# Altium schematic sheet Ultra-Mega-PS-PowerStage-V1.00.SchDoc: Ultra-Mega-PowerSupply
size A4; Author: Felipe Navarro; Revision: 1.0; SheetNumber: 5; SheetTotal: 5; ProjectName: Ultra-Mega-Power-Supply
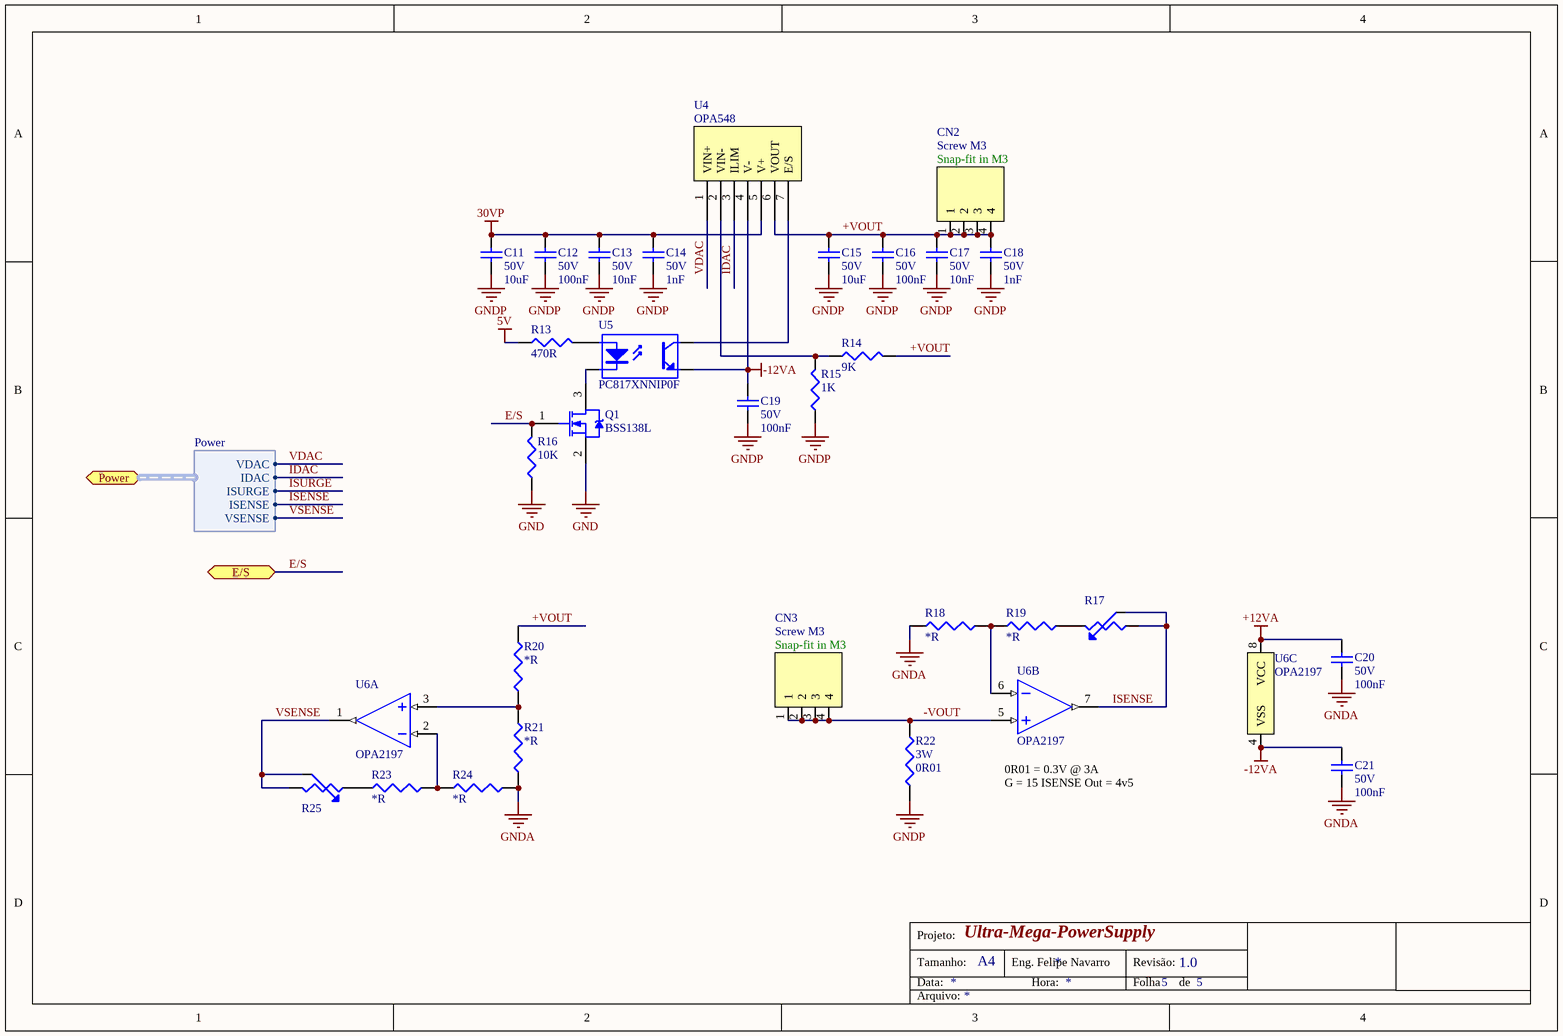
[diagram p0: Ultra-Mega-PS-PowerStage-V1.00.SchDoc]

## Parts
C11  value 10uF  Tensão: 50V  [CC1206]  (hidden comment: Capacitor Cerâmico)
C12  value 100nF  Tensão: 50V  [CC0603]  (hidden comment: Capacitor Cerâmico)
C13  value 10nF  Tensão: 50V  [CC0603]  (hidden comment: Capacitor Cerâmico)
C14  value 1nF  Tensão: 50V  [CC0603]  (hidden comment: Capacitor Cerâmico)
C15  value 10uF  Tensão: 50V  [CC1206]  (hidden comment: Capacitor Cerâmico)
C16  value 100nF  Tensão: 50V  [CC0603]  (hidden comment: Capacitor Cerâmico)
C17  value 10nF  Tensão: 50V  [CC0603]  (hidden comment: Capacitor Cerâmico)
C18  value 1nF  Tensão: 50V  [CC0603]  (hidden comment: Capacitor Cerâmico)
C19  value 100nF  Tensão: 50V  [CC0603]  (hidden comment: Capacitor Cerâmico)
C20  value 100nF  Tensão: 50V  [CC0603]  (hidden comment: Capacitor Cerâmico)
C21  value 100nF  Tensão: 50V  [CC0603]  (hidden comment: Capacitor Cerâmico)
CN2  Screw M3  value Snap-fit in M3  [CONN_MASSA-M3]
CN3  Screw M3  value Snap-fit in M3  [CONN_MASSA-M3]
Q1  BSS138L  [SOT-23-3N]
R13  value 470R  [CC0603]  (hidden comment: Resistor)
R14  value 9K  [CC0603]  (hidden comment: Resistor)
R15  value 1K  [CC0603]  (hidden comment: Resistor)
R16  value 10K  [CC0603]  (hidden comment: Resistor)
R17  Potenciômetro  [POT]  (value not drawn)
R18  value *R  [CC0603]  (hidden comment: Resistor)
R19  value *R  [CC0603]  (hidden comment: Resistor)
R20  value *R  [CC0603]  (hidden comment: Resistor)
R21  value *R  [CC0603]  (hidden comment: Resistor)
R22  value 0R01  Potência: 3W  [CC2512]  (hidden comment: Resistor)
R23  value *R  [CC0603]  (hidden comment: Resistor)
R24  value *R  [CC0603]  (hidden comment: Resistor)
R25  Potenciômetro  [POT]  (value not drawn)
U4  OPA548  [TO-220-7N]
U5  PC817XNNIP0F  [SMD-4N]
U6  OPA2197  [SOIC-8N]  (parts A,B,C of 3)

## Ports
E/S, Power (harness Power)

## Harnesses
Power: VDAC, IDAC, ISENSE, VSENSE, ISURGE

## Nets
5V: R13.1
30VP: C11.2 C12.2 C13.2 C14.2 U4.5(V+)
+12VA: C20.2 U6.8(VCC)
-12VA: C19.2 C21.2 U4.4(V-) U5.3(S) U6.4(VSS)
GND: Q1.2(S) R16.1
GNDA: C20.1 C21.1 R18.1 R21.1 R24.2
GNDP: C11.1 C12.1 C13.1 C14.1 C15.1 C16.1 C17.1 C18.1 C19.1 R15.1 R22.1
+VOUT: C15.2 C16.2 C17.2 C18.2 CN2.1 CN2.2 CN2.3 CN2.4 R14.1 R20.2 U4.6(VOUT)
-VOUT: CN3.1 CN3.2 CN3.3 CN3.4 R22.2 U6.5(INB+)
E/S: Q1.1(G) R16.2 ; port E/S
IDAC: U4.3(ILIM) ; port Power.IDAC
ISENSE: R17.2(TAP) R17.3 U6.7(OUTB) ; port Power.ISENSE
ISURGE: port Power.ISURGE
VDAC: U4.1(VIN+) ; port Power.VDAC
VSENSE: R25.2(TAP) R25.3 U6.1(OUTA) ; port Power.VSENSE
NetQ1_3: Q1.3(D) U5.2(K)
NetR13_2: R13.2 U5.1(A)
NetR14_2: R14.2 R15.2 U4.2(VIN-)
NetR17_1: R17.1 R19.2
NetR18_2: R18.2 R19.1 U6.6(INB-)
NetR20_1: R20.1 R21.2 U6.3(INA+)
NetR23_1: R23.1 R25.1
NetR23_2: R23.2 R24.1 U6.2(INA-)
NetU4_7: U4.7(E/S) U5.4(D)

## Notes on the sheet
- (near U6) 0R01 = 0.3V @ 3A
  G = 15 ISENSE Out = 4v5
- Projeto:
- Tamanho:
- Data:
- A4
- Eng. Felipe Navarro
- Hora:
- Revisão:
- Folha
- de
- Arquivo:

## Library data of the parts
C11 C15 = Cap 10uF 50V 1206 X5R: Capacitor (Semiconductor SIM Model); Chinês: -----; ChinesePrice: 0,00000; Corrente: *A; Potência: *W; Obs:: X5R, CL31A106KBHNNNE; Tolerância: ±10%; Supplier 1: Digi-Key; Supplier Part Number 1: 1276-2876-1-ND; ComponentLink1Description: Datasheet; ComponentLink1URL: D:\Tecnoclade\Datasheet\!DataMissing.pdf
C12 C16 C19-C21 = Cap 100nF 50V 0603 X7R: Capacitor (Semiconductor SIM Model); Chinês: Local; ChinesePrice: 0,00250; Corrente: *A; Potência: *W; Obs:: X7R; Tolerância: ±10%; Supplier 1: Digi-Key; Supplier Part Number 1: 1276-1000-1-ND; ComponentLink1Description: Datasheet; ComponentLink1URL: D:\Tecnoclade\Datasheet\!DataMissing.pdf
C13 C17 = Cap 10nF 50V 0603 X7R 5%: Capacitor (Semiconductor SIM Model); Chinês: Local; ChinesePrice: 0,00320; Corrente: *A; Potência: *W; Obs:: X7R; Tolerância: ±5%; Supplier 1: Digi-Key; Supplier Part Number 1: 399-1092-1-ND; ComponentLink1Description: Datasheet; ComponentLink1URL: D:\Tecnoclade\Datasheet\!DataMissing.pdf
C14 C18 = Cap 1nF 50V 0603 X7R: Capacitor (Semiconductor SIM Model); Chinês: -----; ChinesePrice: 0,00000; Corrente: *A; Potência: *W; Obs:: X7R; Tolerância: ±10%; Supplier 1: Digi-Key; Supplier Part Number 1: 1276-1916-1-ND; ComponentLink1Description: Datasheet; ComponentLink1URL: D:\Tecnoclade\Datasheet\!DataMissing.pdf
CN2 CN3 = Screw Snap-Fit M3: TERM PCB SNAP-IN VERT M3 THREAD; ChinesePrice: 0,00000; Chinês: -----; Corrente: 15A; Obs:: Screw Terminal, Power Tap; Potência: *; Supplier 1: Digi-Key; Supplier Part Number 1: 7788K-ND; Tensão: *; Tolerância: *; ComponentLink1Description: Datasheet; ComponentLink1URL: D:\Tecnoclade\Datasheet\!DataMissing.pdf
Q1 = TRS BSS138 50V 200mA SOT-23-3N: N-Channel Power MOSFET; ChinesePrice: 0,02950; Chinês: Local; Corrente: 200mA; Potência: 1/5W; Tensão: 50V; Supplier 1: Digi-Key; Supplier Part Number 1: BSS138LT3GOSCT-ND; Value: *; Obs:: *; Tolerância: *; ComponentLink1Description: Datasheet; ComponentLink1URL: D:\Tecnoclade\Datasheet\!DataMissing.pdf
R13 = Res 470R 5% 0603 1/10W: ChinesePrice: 0,00000; Chinês: ----; Corrente: *A; Potência: 1/10W; Tensão: *V; Obs: ±200ppm/ºC; Tolerância: ±5%; Supplier 1: Digi-Key; Supplier Part Number 1: RMCF0603JT470RCT-ND; ComponentLink1Description: Datasheet; ComponentLink1URL: D:\Tecnoclade\Datasheet\!DataMissing.pdf
R14 = Res 9K09 1% 0603 1/10W: ChinesePrice: 0,00000; Chinês: ----; Corrente: *A; Potência: 1/10W; Tensão: *V; Obs: ±100ppm/ºC; Tolerância: ±1%; Supplier 1: Digi-Key; Supplier Part Number 1: RMCF0603FT9K0CT-ND; ComponentLink1Description: Datasheet; ComponentLink1URL: D:\Tecnoclade\Datasheet\!DataMissing.pdf
R15 = Res 1K 1% 0603 1/10W: ChinesePrice: 0,00089; Chinês: Local; Corrente: *A; Potência: 1/10W; Tensão: *V; Tolerância: ±1%; Supplier 1: Digi-Key; Supplier Part Number 1: RMCF0603FT1K00CT-ND; Obs: *; ComponentLink1Description: Datasheet; ComponentLink1URL: D:\Tecnoclade\Datasheet\!DataMissing.pdf
R16 = Res 10K 1% 0603 1/10W: ChinesePrice: 0,00089; Chinês: Local; Corrente: *A; Potência: 1/10W; Tensão: *V; Tolerância: ±1%; Supplier 1: Digi-Key; Supplier Part Number 1: P10.0KHCT-ND; Obs: *; ComponentLink1Description: Datasheet; ComponentLink1URL: D:\Tecnoclade\Datasheet\!DataMissing.pdf
R17 R25 = Res Trim: Trimmer; ChinesePrice: 0,00000; Chinês: ----; Corrente: *A; Potência: *W; Tensão: *V; Tolerância: ±*%; Value: 1K; Supplier 1: Digi-Key; Supplier Part Number 1: --Del; Obs: *; ComponentLink1Description: Datasheet; ComponentLink1URL: D:\Tecnoclade\Datasheet\!DataMissing.pdf
R18-R21 R23 R24 = Res - $Val $% $Footprint $Pot: ChinesePrice: 0,00000; Chinês: ----; Corrente: *A; Potência: 1/10W; Tensão: *V; Tolerância: ±*%; Supplier 1: Digi-Key; Supplier Part Number 1: --Del; Obs:: *; ComponentLink1Description: Datasheet; ComponentLink1URL: D:\Tecnoclade\Datasheet\!DataMissing.pdf
R22 = Res 0R01 1% 2512 3W: ChinesePrice: 0,00000; Chinês: ----; Corrente: *A; Tensão: *V; Tolerância: 1%; Supplier 1: Digi-Key; Supplier Part Number 1: 696-1185-1-ND; Obs:: *; ComponentLink1Description: Datasheet; ComponentLink1URL: D:\Tecnoclade\Datasheet\!DataMissing.pdf
U4 = OPA548: High-Voltage, High-Current  OPERATIONAL AMPLIFIER; ChinesePrice: 0,00000; Chinês: ----; Supplier 1: Digi-Key; Supplier Part Number 1: OPA548T-ND; Corrente: *; Potência: *; Tensão: *; Value: *; Obs:: *; Tolerância: *; ComponentLink1Description: Datasheet; ComponentLink1URL: D:\Tecnoclade\Datasheet\
U5 = OPT PC817: 4-Pin Phototransistor Optocoupler; ChinesePrice: 0,00000; Chinês: ----; Corrente: *; Potência: *; Supplier 1: Digi-Key; Supplier Part Number 1: 425-2774-1-ND; Tensão: *; Value: *; Obs:: *; Tolerância: *; ComponentLink1Description: Datasheet; ComponentLink1URL: D:\Tecnoclade\Datasheet\!DataMissing.pdf
U6 = OPA2197: OPAx197 36-V, Precision, Rail-to-Rail Input/Output, Low Offset Voltage, Operational Amplifiers; Chinês: ----; ChinesePrice: 0,00000; Tensão: 36V; Value: 10MHz; Corrente: 65mA; Potência: *; Supplier 1: Digi-Key; Obs:: Rail-To-Rail; Tolerância: *; ComponentLink1Description: Datasheet; ComponentLink1URL: D:\Tecnoclade\Datasheet\